# EAGLE design soundMeter (EAGLE 6.3)
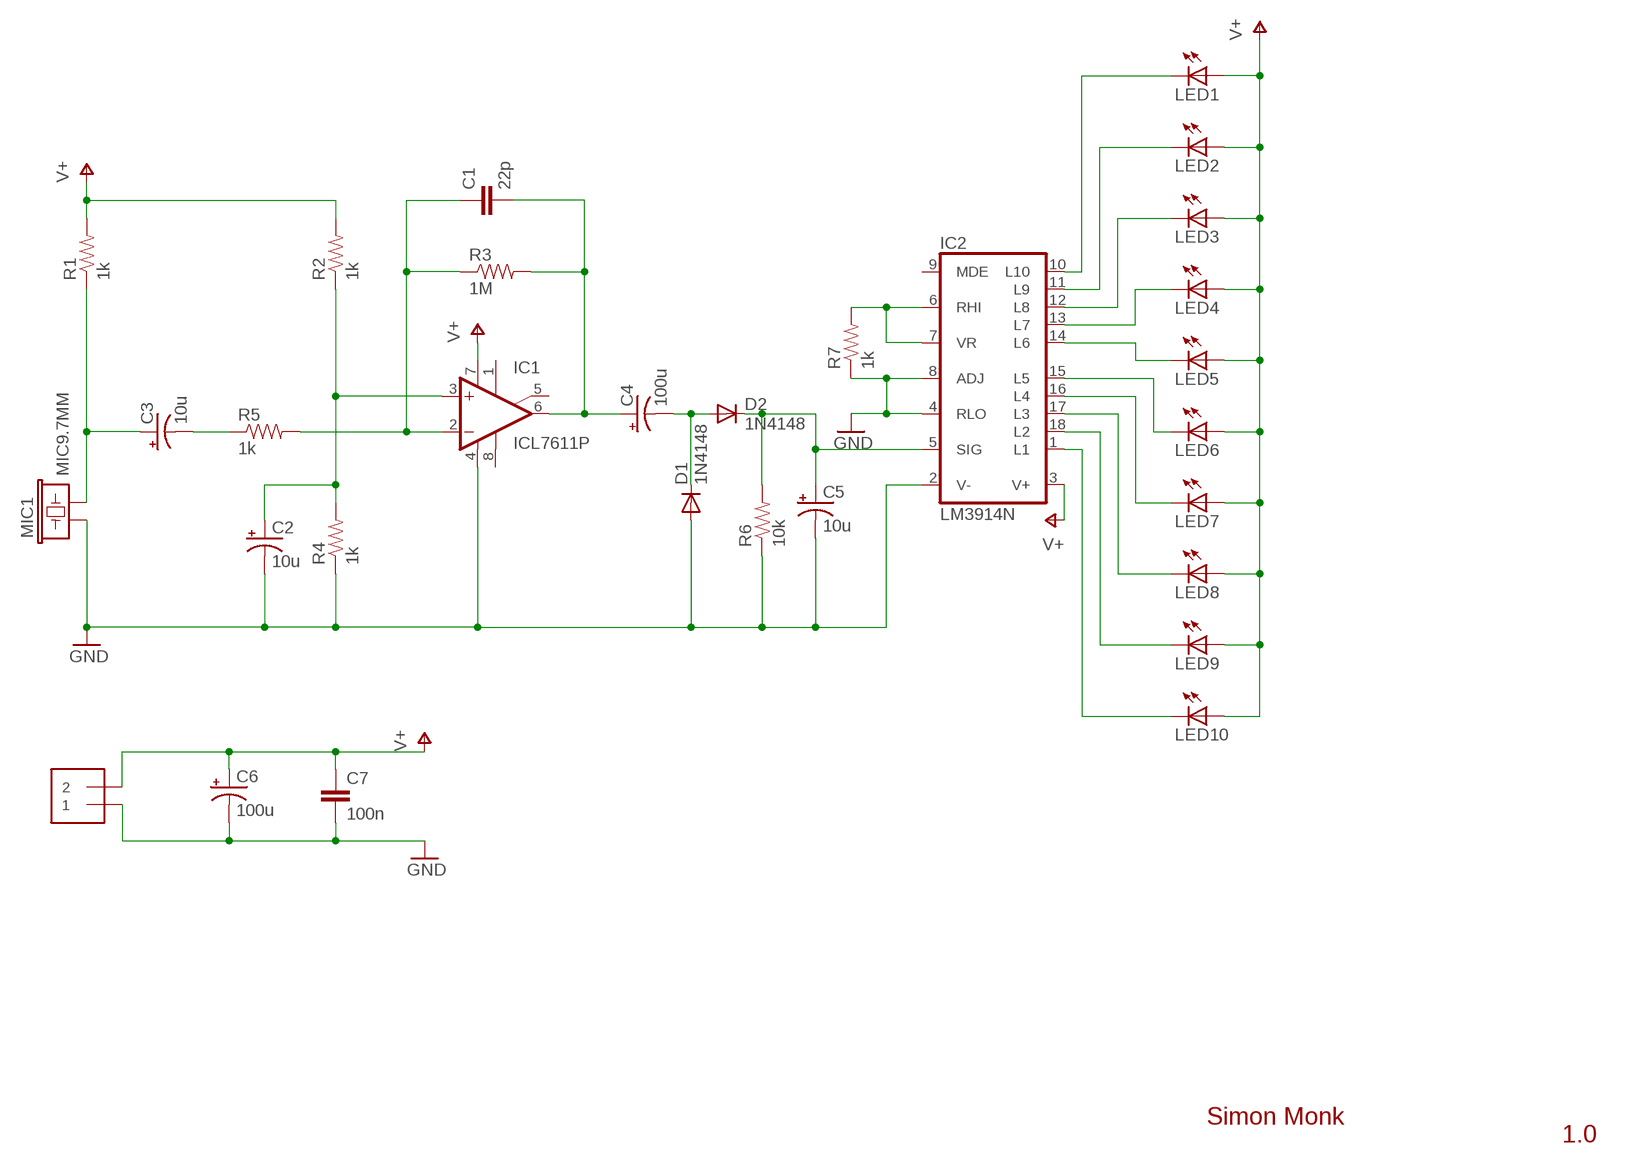
[diagram p0: schematic, sheet 1]

## Parts
C1  22p  CAPPTH  [CAP-PTH-SMALL]
C2  10u  CAP_POLPTH2  [CPOL-RADIAL-10UF-25V]
C3  10u  CAP_POLPTH2  [CPOL-RADIAL-10UF-25V]
C4  100u  CAP_POLPTH2  [CPOL-RADIAL-10UF-25V]
C5  10u  CAP_POLPTH2  [CPOL-RADIAL-10UF-25V]
C6  100u  CAP_POLPTH2  [CPOL-RADIAL-10UF-25V]
C7  100n  CAPPTH  [CAP-PTH-SMALL]
D1  1N4148  1N4148DO35-7  [DO35-7]
D2  1N4148  1N4148DO35-7  [DO35-7]
IC1  ICL7611P  [DIL08]
IC2  LM3914N  [DIL18]
J1  1X2-3.5MM  [1X2-3.5MM]
LED1  LED3MM  [LED3MM]
LED2  LED3MM  [LED3MM]
LED3  LED3MM  [LED3MM]
LED4  LED3MM  [LED3MM]
LED5  LED3MM  [LED3MM]
LED6  LED3MM  [LED3MM]
LED7  LED3MM  [LED3MM]
LED8  LED3MM  [LED3MM]
LED9  LED3MM  [LED3MM]
LED10  LED3MM  [LED3MM]
MIC1  MIC9.7MM  [MIC-9.7MM]
R1  1k  RESISTORPTH-1/4W  [AXIAL-0.4]
R2  1k  RESISTORPTH-1/4W  [AXIAL-0.4]
R3  1M  RESISTORPTH-1/4W  [AXIAL-0.4]
R4  1k  RESISTORPTH-1/4W  [AXIAL-0.4]
R5  1k  RESISTORPTH-1/4W  [AXIAL-0.4]
R6  10k  RESISTORPTH-1/4W  [AXIAL-0.4]
R7  1k  RESISTORPTH-1/4W  [AXIAL-0.4]

## Nets
GND [supply]: C2.2(-) C5.2(-) C6.2(-) C7.2 D1.A IC1.4(V-) IC2.2(V-) IC2.4(RLO) IC2.8(ADJ) J1.1 MIC1.1 R4.P$1 R6.P$1 R7.P$1
N$1: C4.2(-) D1.C D2.A
N$2: C3.1(+) MIC1.2 R1.P$1
N$3: C5.1(+) D2.C IC2.5(SIG) R6.P$2
N$4: C2.1(+) IC1.3(+IN) R2.P$1 R4.P$2
N$5 [supply]: C3.2(-) R5.P$1
N$6: C1.1 IC1.2(-IN) R3.P$1 R5.P$2
N$7: C1.2 C4.1(+) IC1.6(OUT) R3.P$2
N$8: IC2.6(RHI) IC2.7(VR) R7.P$2
N$9: IC2.10(L10) LED1.K(C)
N$10: IC2.11(L9) LED2.K(C)
N$11: IC2.12(L8) LED3.K(C)
N$12: IC2.13(L7) LED4.K(C)
N$13: IC2.14(L6) LED5.K(C)
N$14: IC2.15(L5) LED6.K(C)
N$15: IC2.16(L4) LED7.K(C)
N$16: IC2.17(L3) LED8.K(C)
N$17: IC2.18(L2) LED9.K(C)
N$18: IC2.1(L1) LED10.K(C)
V+ [supply]: C6.1(+) C7.1 IC1.7(V+) IC2.3(V+) J1.2 LED1.A LED2.A LED3.A LED4.A LED5.A LED6.A LED7.A LED8.A LED9.A LED10.A R1.P$2 R2.P$2
Unconnected: IC1.1(ON1) IC1.5(ON2) IC1.8(OPT) IC2.9(MDE)

## Notes on the sheet
- Simon Monk
- 1.0

## Library data of the parts
C1 C7 = SparkFun-Capacitors:CAP: Capacitor Standard 0603 ceramic capacitor, and 0.1" leaded capacitor.
C2-C6 = SparkFun-Capacitors:CAP_POL: Capacitor Polarized These are standard SMD and PTH capacitors. Normally 10uF, 47uF, and 100uF in electrolytic and tantalum varieties. Always verify the external diameter of the through hole cap, it varies with capacity, voltage, and manufacturer. The EIA devices should be standard.
D1 D2 = diode:1N4148: DIODE high speed (Philips)
IC1 = linear:ICL7611: OP AMP
IC2 = linear:LM3914N: LED DRIVER senses analog voltage levels and drives 10 LEDs
J1 = adafruit:1X2: 3.5mm Terminal block http://www.ladyada.net/library/pcb/eaglelibrary.html
LED1-LED10 = adafruit:LED: LED OSRAM: - CHIPLED LG R971, LG N971, LY N971, LG Q971, LY Q971, LO R971, LY R971 LH N974, LH R974 LS Q976, LO Q976, LY Q976 LO Q996 - Hyper CHIPLED LW Q18S LB Q993, LB Q99A, LB R99A - SideLED LS A670, LO A670, LY A670, LG A670, LP A670 LB A673, LV A673, LT A673, LW A673 LH A674 LY A675 LS A676, LA A676, LO A676, LY A676, LW A676 LS A679, LY A679, LG A679 - Hyper Micro SIDELED® LS Y876, LA Y876, LO Y876, LY Y876 LT Y87S - SmartLED LW L88C, LW L88S LB L89C, LB L89S, LG L890 LS L89K, LO L89K, LY L89K LS L896, LA L896, LO L896, LY L896 - TOPLED LS T670, LO T670, LY T670, LG T670, LP T670 LSG T670, LSP T670, LSY T670, LOP T670, LYG T670 LG T671, LOG T671, LSG T671 LB T673, LV T673, LT T673, LW T673 LH T674 LS T676, LA T676, LO T676, LY T676, LB T676, LH T676, LSB T676, LW T676 LB T67C, LV T67C, LT T67C, LS T67K, LO T67K, LY T67K, LW E67C LS E67B, LA E67B, LO E67B, LY E67B, LB E67C, LV E67C, LT E67C LW T67C LS T679, LY T679, LG T679 LS T770, LO T770, LY T770, LG T770, LP T770 LB T773, LV T773, LT T773, LW T773 LH T774 LS E675, LA E675, LY E675, LS T675 LS T776, LA T776, LO T776, LY T776, LB T776 LHGB T686 LT T68C, LB T68C - Hyper Mini TOPLED® LB M676 - Mini TOPLED Santana® LG M470 LS M47K, LO M47K, LY M47K Source: http://www.osram.convergy.de/
MIC1 = SparkFun-Sensors:MIC: Omni-directional electret microphone. 9.7mm standard diameter.
R1-R7 = SparkFun-Passives:RESISTOR: Resistor Basic schematic elements and footprints for 0603, 1206, and PTH resistors.

## Net classes
0 default: width 0.254 mm, clearance 0.254 mm
1 supply: width 0.508 mm, clearance 0.508 mm

## Board
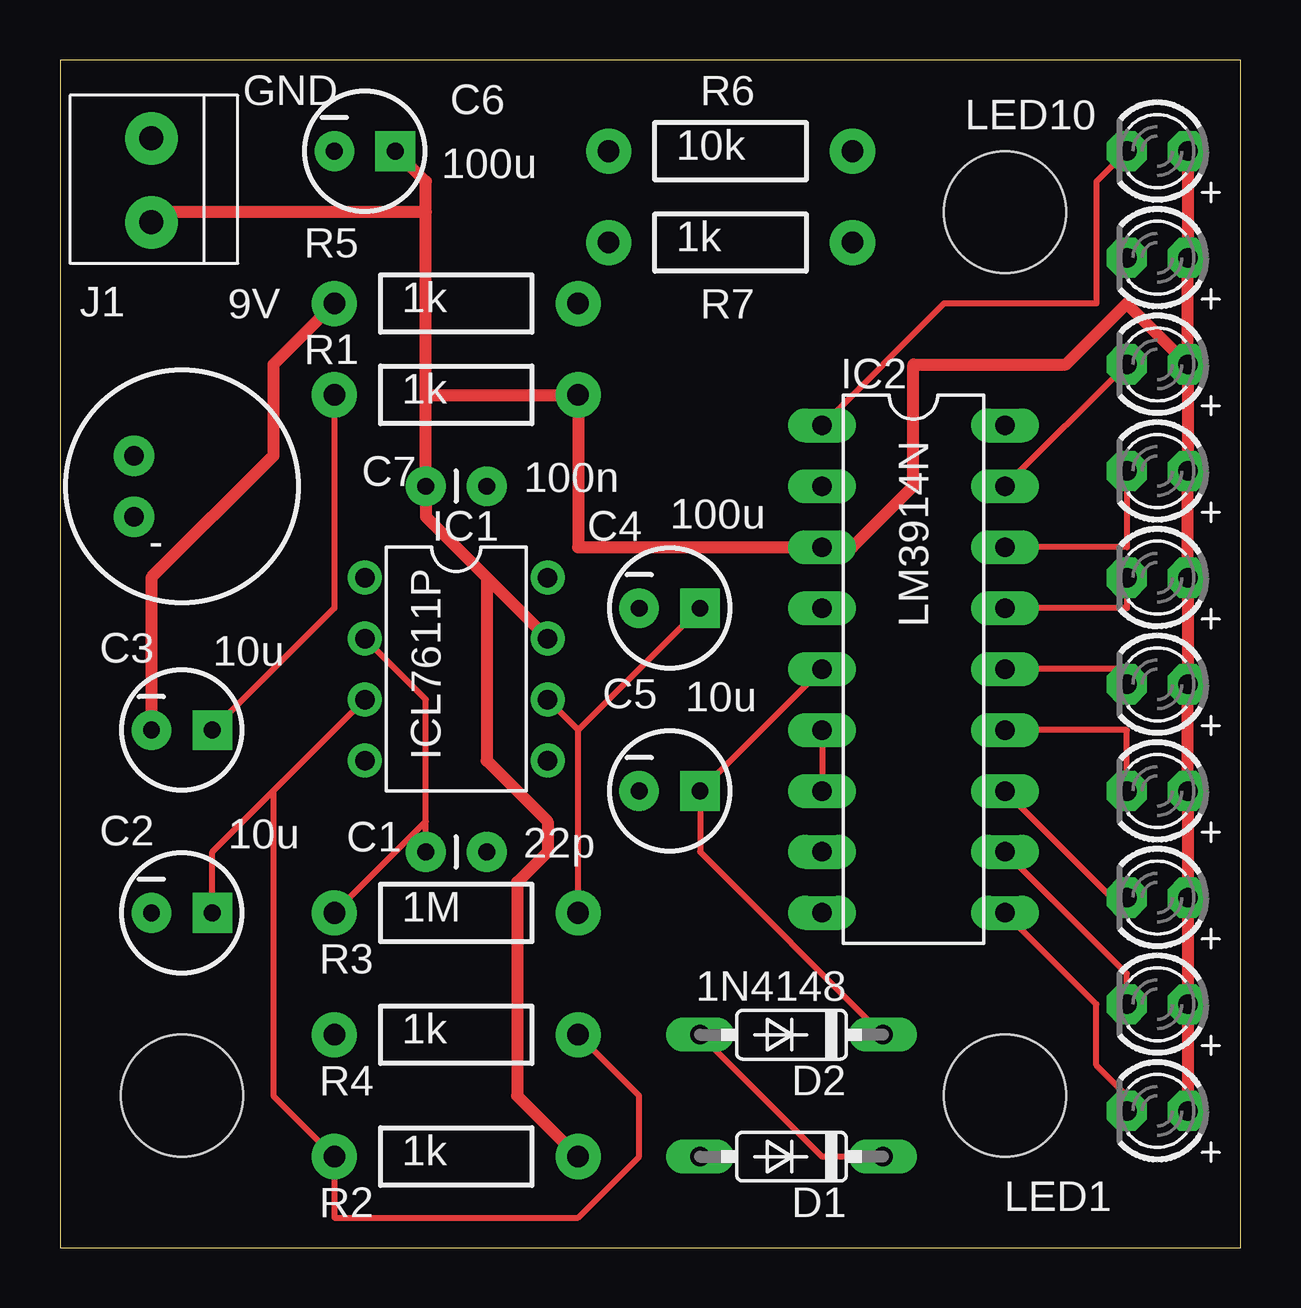
[diagram p1: board, top side]
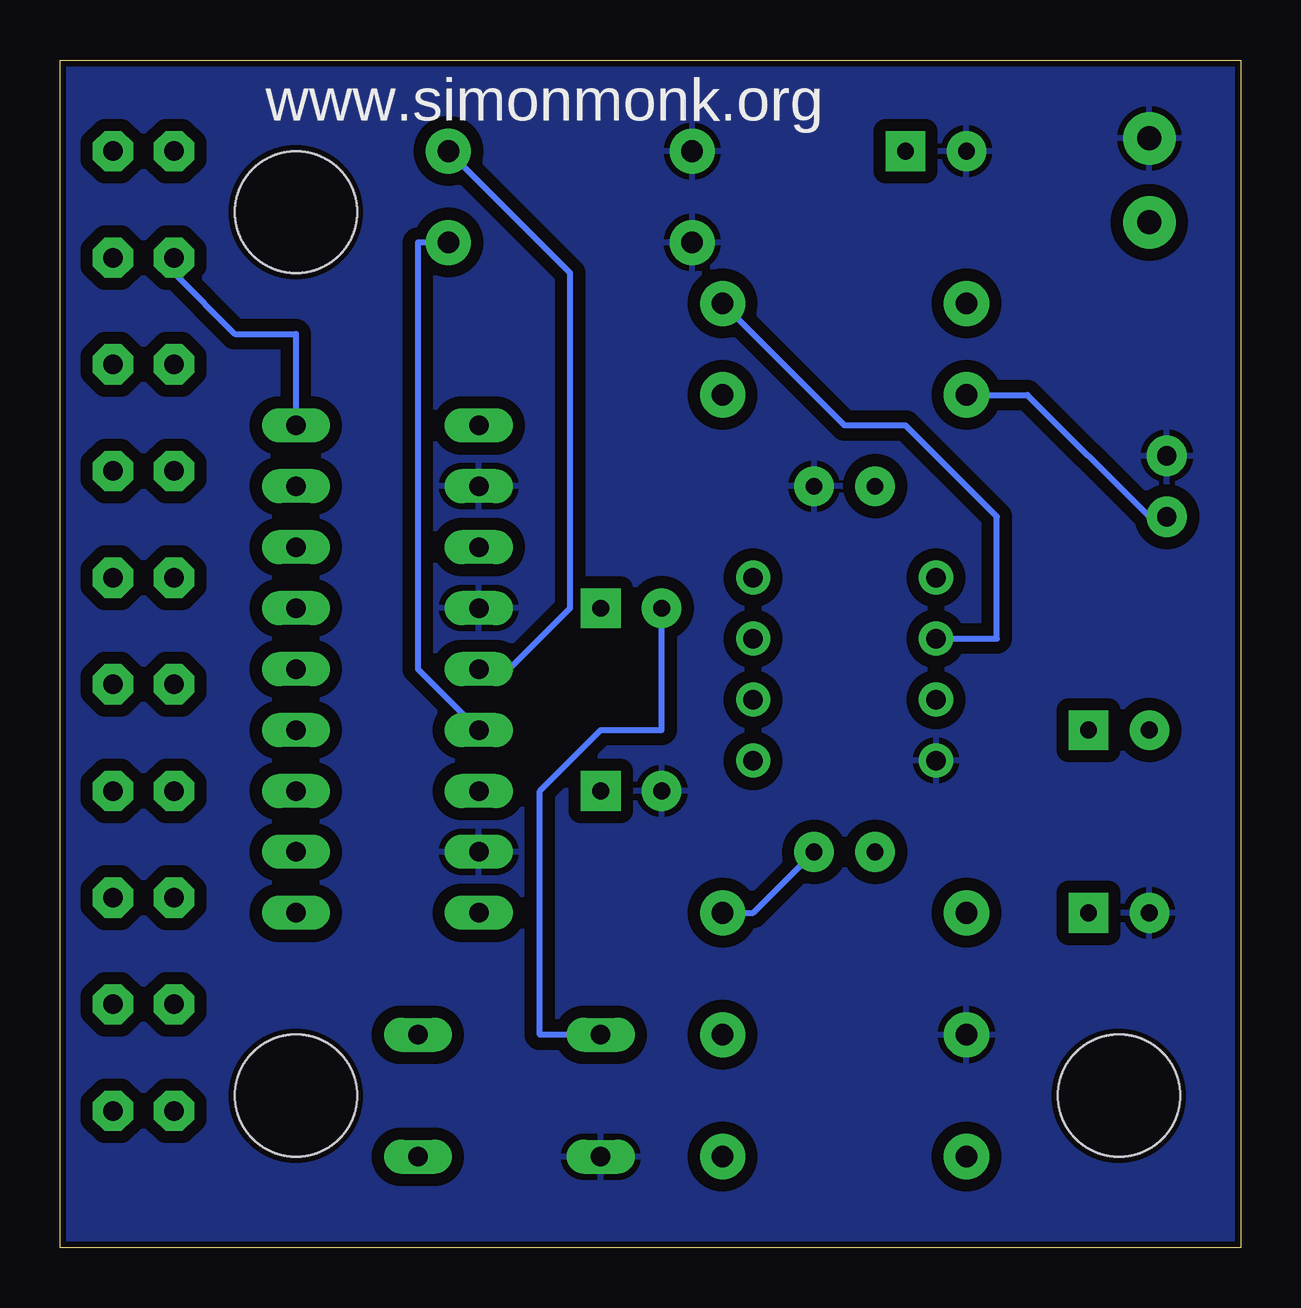
[diagram p2: board, bottom side, seen from below]

Size 49.2 x 49.52 mm. Coordinates in mm from the lower left corner, seen from the top.
Outline: 0,0 49.2,0 49.2,49.52 0,49.52 0,0
Copper layers (1*16): Top 0.035mm / dielectric 1.5mm / Bottom 0.035mm
Design rules "SparkFun": minimum track width 8mil, minimum drill 20mil, track to track 8mil, track to pad 8mil, pad to pad 8mil, via to via 8mil, smd to smd 8mil, copper to edge 10mil, drill to drill 8mil, minimum pad ring 12mil, minimum via ring 10mil, stop-mask expansion 4mil, vias tented up to drill 25mil, thermal gap 10mil
Holes 5.08 mm at 39.37,43.18 39.37,6.35 5.08,6.35

### Footprints (pad centres in the part's own frame; a part is rotated, then mirrored left to right if it is on the bottom)
CAP-PTH-SMALL = drill 0.7 pad 1.651: 1 0,0; 2 2.54,0
CPOL-RADIAL-10UF-25V = drill 0.7 pad 1.651 square: 1 1.27,0 | drill 0.7 pad 1.651: 2 -1.27,0
DO35-7 = drill 0.813 long: A 3.81,0; C -3.81,0
DIL08 = drill 0.813 pad 1.27: 1 -3.81,-3.81; 2 -1.27,-3.81; 3 1.27,-3.81; 4 3.81,-3.81; 5 3.81,3.81; 6 1.27,3.81; 7 -1.27,3.81; 8 -3.81,3.81
DIL18 = drill 0.813 long: 1 -10.16,-3.81; 2 -7.62,-3.81; 3 -5.08,-3.81; 4 -2.54,-3.81; 5 0,-3.81; 6 2.54,-3.81; 7 5.08,-3.81; 8 7.62,-3.81; 9 10.16,-3.81; 10 10.16,3.81; 11 7.62,3.81; 12 5.08,3.81; 13 2.54,3.81; 14 0,3.81; 15 -2.54,3.81; 16 -5.08,3.81; 17 -7.62,3.81; 18 -10.16,3.81
1X2-3.5MM = drill 1 pad 2.184: 1 1.8,0; 2 -1.7,0
LED3MM = drill 0.813 pad 1.676 octagon: A -1.27,0; K 1.27,0
MIC-9.7MM = drill 0.8 pad 1.676: 1 -2,1.27; 2 -2,-1.27
AXIAL-0.4 = drill 0.9 pad 1.88: P$1 -5.08,0; P$2 5.08,0

### Placement (x,y rotation side)
C1  15.24,16.51 0 top
C2  5.08,13.97 0 top
C3  5.08,21.59 0 top
C4  25.4,26.67 0 top
C5  25.4,19.05 0 top
C6  12.7,45.72 0 top
C7  15.24,31.75 0 top
D1  30.48,3.81 180 top
D2  30.48,8.89 180 top
IC1  16.51,24.13 270 top
IC2  35.56,24.13 270 top
J1  3.81,44.45 90 top
LED1  45.72,5.71 180 top
LED2  45.72,10.16 180 top
LED3  45.72,14.61 180 top
LED4  45.72,19.05 180 top
LED5  45.72,23.5 180 top
LED6  45.72,27.94 180 top
LED7  45.72,32.38 180 top
LED8  45.72,36.83 180 top
LED9  45.72,41.27 180 top
LED10  45.72,45.72 180 top
MIC1  5.08,31.75 0 top
R1  16.51,35.56 0 top
R2  16.51,3.81 0 top
R3  16.51,13.97 0 top
R4  16.51,8.89 0 top
R5  16.51,39.37 0 top
R6  27.94,45.72 0 top
R7  27.94,41.91 0 top

### Tracks (layer width: path | path; a pad name or v marks a point on that pad's centre or on a via)
GND
  pour Bottom: 0,49.53 49.53,49.53 49.53,0 0,0
N$1
  Top 0.254: D2.A 31.75,3.81 D1.C
  Bottom 0.254: C4.2 24.13,21.59 26.67,21.59 29.21,19.05 29.21,8.89 D2.A
N$2
  Top 0.254: C3.1 11.43,26.67 R1.P$1
  Bottom 0.254: R1.P$1 8.89,35.56 3.81,30.48 MIC1.2
N$3
  Top 0.254: D2.C 26.67,16.51 C5.1 IC2.5
  Bottom 0.254: R6.P$2 27.94,40.64 27.94,26.67 30.48,24.13 IC2.5
N$4
  Top 0.254: 8.89,19.05 6.35,16.51 C2.1 | 8.89,19.05 IC1.3 | 8.89,19.05 8.89,6.35 R2.P$1 11.43,1.27 21.59,1.27 24.13,3.81 24.13,6.35 R4.P$2
N$5
  Top 0.508: C3.2 3.81,27.94 8.89,33.02 8.89,36.83 R5.P$1
N$6
  Top 0.254: IC1.2 15.24,22.86 15.24,17.78 | C1.1 15.24,17.78 | 15.24,17.78 R3.P$1
  Bottom 0.254: R5.P$2 16.51,34.29 13.97,34.29 10.16,30.48 10.16,25.4 IC1.2
N$7
  Top 0.254: 21.59,21.59 IC1.6 | R3.P$2 21.59,21.59 | 21.59,21.59 C4.1
  Bottom 0.254: C1.2 20.32,13.97 R3.P$2
N$8
  Top 0.254: IC2.6 IC2.7
  Bottom 0.254: IC2.6 34.29,24.13 34.29,41.91 R7.P$2
N$9
  Top 0.254: IC2.10 43.18,10.16 43.18,7.62 44.45,6.35 LED1.K
N$10
  Top 0.254: IC2.11 44.45,11.43 LED2.K
N$11
  Top 0.254: IC2.12 44.45,13.97 LED3.K
N$12
  Top 0.254: IC2.13 44.45,21.59 LED4.K
N$13
  Top 0.254: IC2.14 44.45,24.13 LED5.K
N$14
  Top 0.254: IC2.15 44.45,26.67 LED6.K
N$15
  Top 0.254: IC2.16 44.45,29.21 LED7.K
N$16
  Top 0.254: LED8.K IC2.17
N$17
  Bottom 0.254: IC2.18 39.37,38.1 41.91,38.1 44.45,40.64 LED9.K
N$18
  Top 0.254: IC2.1 36.83,39.37 43.18,39.37 43.18,44.45 LED10.K
V+
  Top 0.508: LED10.A LED9.A LED8.A | LED8.A LED7.A LED6.A LED5.A LED4.A LED3.A LED2.A LED1.A | 17.78,27.94 15.24,30.48 C7.1 15.24,35.56 | 17.78,27.94 IC1.7 | C6.1 15.24,44.45 15.24,43.18 | 15.24,35.56 15.24,43.18 | R2.P$2 19.05,6.35 19.05,15.24 20.32,16.51 20.32,17.78 17.78,20.32 17.78,27.94 | 15.24,43.18 3.81,43.18 J1.2 | 15.24,35.56 R1.P$2 21.59,29.21 IC2.3 33.02,29.21 35.56,31.75 35.56,36.83 41.91,36.83 44.45,39.37 LED8.A

### Text on the board
tPlace: GND | 9V
bPlace: www.simonmonk.org | www.simonmonk.org